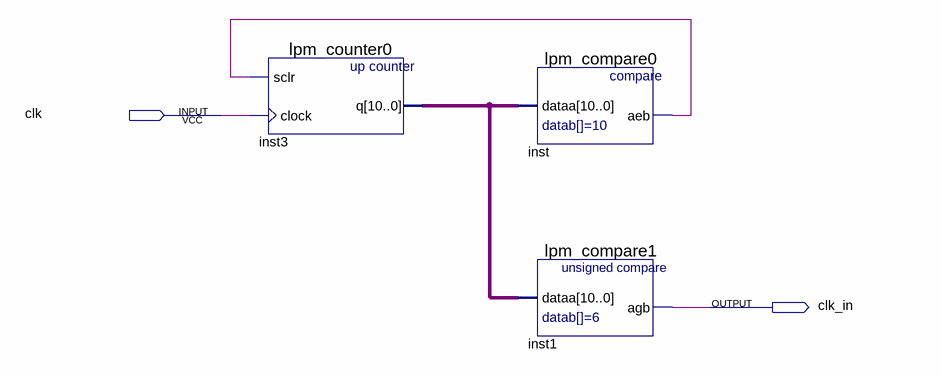
[diagram p0: schematic sheet]
// Quartus schematic block1.bdf as structural Verilog: 3 symbols, 2 pins
module block1 (
  input  clk,
  output clk_in
);

  wire inst_aeb;
  wire [10:0] inst3_q;

  lpm_counter0 inst3 (.sclr(inst_aeb), .clock(clk), .q(inst3_q));
  lpm_compare0 inst (.dataa(inst3_q), .aeb(inst_aeb));
  lpm_compare1 inst1 (.dataa(inst3_q), .agb(clk_in));
endmodule
